# Altium schematic sheet 14 - mBUS-CAN.SchDoc
size B; CompanyName: Microchip Technology Inc.; Organization: Microchip Technology; Address1: 2355 West Chandler Blvd.; Address2: Chandler, AZ  85224; Address4: USA; DocumentNumber: 14; SheetNumber: 14; SheetTotal: 15; SheetTitle: mikroBUS CAN; Time: Time
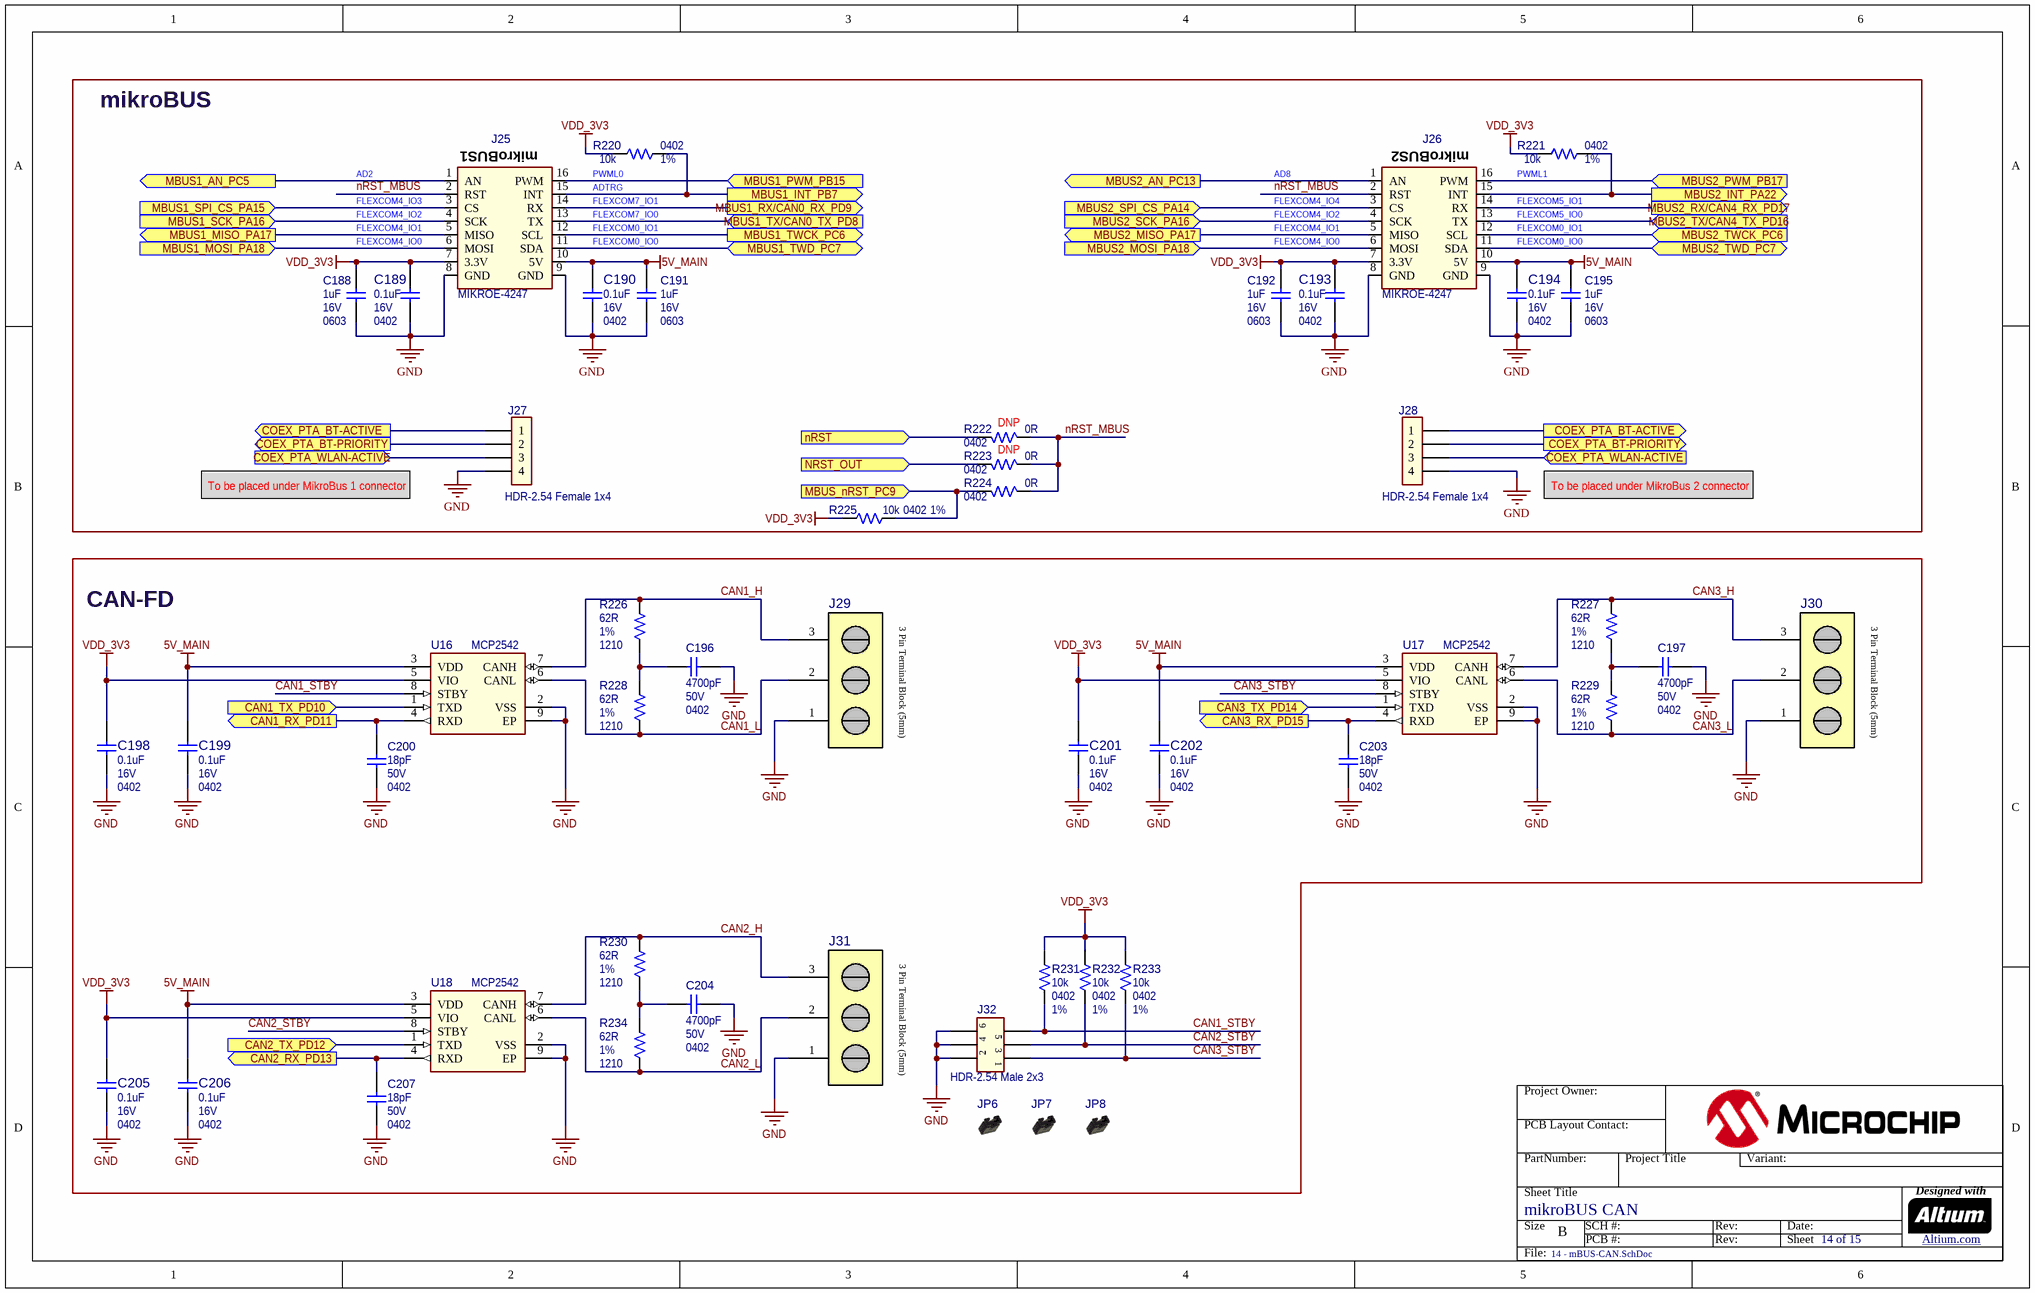
[diagram p0: 14 - mBUS-CAN.SchDoc]

## Parts
C188  value 1uF  Voltage: 16V  Package: 0603  [CAP_C_0603]  (hidden comment: Capacitor NP)
C189  value 0.1uF  Voltage: 16V  Package: 0402  [CAP_C_0402]  (hidden comment: Capacitor NP)
C190  value 0.1uF  Voltage: 16V  Package: 0402  [CAP_C_0402]  (hidden comment: Capacitor NP)
C191  value 1uF  Voltage: 16V  Package: 0603  [CAP_C_0603]  (hidden comment: Capacitor NP)
C192  value 1uF  Voltage: 16V  Package: 0603  [CAP_C_0603]  (hidden comment: Capacitor NP)
C193  value 0.1uF  Voltage: 16V  Package: 0402  [CAP_C_0402]  (hidden comment: Capacitor NP)
C194  value 0.1uF  Voltage: 16V  Package: 0402  [CAP_C_0402]  (hidden comment: Capacitor NP)
C195  value 1uF  Voltage: 16V  Package: 0603  [CAP_C_0603]  (hidden comment: Capacitor NP)
C196  value 4700pF  Voltage: 50V  Package: 0402  [CAP_C_0402]  (hidden comment: Capacitor NP)
C197  value 4700pF  Voltage: 50V  Package: 0402  [CAP_C_0402]  (hidden comment: Capacitor NP)
C198  value 0.1uF  Voltage: 16V  Package: 0402  [CAP_C_0402]  (hidden comment: Capacitor NP)
C199  value 0.1uF  Voltage: 16V  Package: 0402  [CAP_C_0402]  (hidden comment: Capacitor NP)
C200  value 18pF  Voltage: 50V  Package: 0402  [CAP_C_0402]  (hidden comment: Capacitor NP)
C201  value 0.1uF  Voltage: 16V  Package: 0402  [CAP_C_0402]  (hidden comment: Capacitor NP)
C202  value 0.1uF  Voltage: 16V  Package: 0402  [CAP_C_0402]  (hidden comment: Capacitor NP)
C203  value 18pF  Voltage: 50V  Package: 0402  [CAP_C_0402]  (hidden comment: Capacitor NP)
C204  value 4700pF  Voltage: 50V  Package: 0402  [CAP_C_0402]  (hidden comment: Capacitor NP)
C205  value 0.1uF  Voltage: 16V  Package: 0402  [CAP_C_0402]  (hidden comment: Capacitor NP)
C206  value 0.1uF  Voltage: 16V  Package: 0402  [CAP_C_0402]  (hidden comment: Capacitor NP)
C207  value 18pF  Voltage: 50V  Package: 0402  [CAP_C_0402]  (hidden comment: Capacitor NP)
J25  value MIKROE-4247  [SOCKET_mikroBUS_F_2.54_2x8_V_25.4x21_original]  (hidden comment: SOCKET mikroBUS HOST)
J26  value MIKROE-4247  [SOCKET_mikroBUS_F_2.54_2x8_V_25.4x21_original]  (hidden comment: SOCKET mikroBUS HOST)
J27  value HDR-2.54 Female 1x4  [HDR_F_2.54_1x4]  (hidden comment: Header 1x4)
J28  value HDR-2.54 Female 1x4  [HDR_F_2.54_1x4]  (hidden comment: Header 1x4)
J29  CON TERM BLK 1x3 TH Mount  [CON_TERMINAL_3.5_1x3_TH_RA_PHO_1985205]  (value not drawn)
J30  CON TERM BLK 1x3 TH Mount  [CON_TERMINAL_3.5_1x3_TH_RA_PHO_1985205]  (value not drawn)
J31  CON TERM BLK 1x3 TH Mount  [CON_TERMINAL_3.5_1x3_TH_RA_PHO_1985205]  (value not drawn)
J32  value HDR-2.54 Male 2x3  [HDR_M_2.54_2x3]  (hidden comment: Header 2x3)
JP6  Jumper Mechanical  [Jumper_Mechanical]  (value not drawn)  (mechanical)
JP7  Jumper Mechanical  [Jumper_Mechanical]  (value not drawn)  (mechanical)
JP8  Jumper Mechanical  [Jumper_Mechanical]  (value not drawn)  (mechanical)
R220  value 10k  Package: 0402  Tolerance: 1%  [RES_C_0402]  (hidden comment: Resistor)
R221  value 10k  Package: 0402  Tolerance: 1%  [RES_C_0402]  (hidden comment: Resistor)
R222  value 0R  Package: 0402  Populated: DNP  [RES_C_0402]  (hidden comment: Resistor)
R223  value 0R  Package: 0402  Populated: DNP  [RES_C_0402]  (hidden comment: Resistor)
R224  value 0R  Package: 0402  [RES_C_0402]  (hidden comment: Resistor)
R225  value 10k  Package: 0402  Tolerance: 1%  [RES_C_0402]  (hidden comment: Resistor)
R226  value 62R  Package: 1210  Tolerance: 1%  [RES_C_1210]  (hidden comment: Resistor)
R227  value 62R  Package: 1210  Tolerance: 1%  [RES_C_1210]  (hidden comment: Resistor)
R228  value 62R  Package: 1210  Tolerance: 1%  [RES_C_1210]  (hidden comment: Resistor)
R229  value 62R  Package: 1210  Tolerance: 1%  [RES_C_1210]  (hidden comment: Resistor)
R230  value 62R  Package: 1210  Tolerance: 1%  [RES_C_1210]  (hidden comment: Resistor)
R231  value 10k  Package: 0402  Tolerance: 1%  [RES_C_0402]  (hidden comment: Resistor)
R232  value 10k  Package: 0402  Tolerance: 1%  [RES_C_0402]  (hidden comment: Resistor)
R233  value 10k  Package: 0402  Tolerance: 1%  [RES_C_0402]  (hidden comment: Resistor)
R234  value 62R  Package: 1210  Tolerance: 1%  [RES_C_1210]  (hidden comment: Resistor)
U16  value MCP2542  [DFN-8_3x3_EP2.4X1.55]  (hidden comment: MCP2542 DFN-8)
U17  value MCP2542  [DFN-8_3x3_EP2.4X1.55]  (hidden comment: MCP2542 DFN-8)
U18  value MCP2542  [DFN-8_3x3_EP2.4X1.55]  (hidden comment: MCP2542 DFN-8)

## Blocks framed on the sheet
mikroBUS: C188-C195 J25-J28 R220-R225
CAN-FD: C196-C207 J29-J32 JP6-JP8 R226-R234 U16-U18

## Ports
CAN1_RX_PD11 (out), CAN1_TX_PD10 (in), CAN2_RX_PD13 (out), CAN2_TX_PD12 (in), CAN3_RX_PD15 (out), CAN3_TX_PD14 (in), COEX_PTA_BT-ACTIVE (out), COEX_PTA_BT-PRIORITY (out), COEX_PTA_WLAN-ACTIVE (in), MBUS1_AN_PC5 (out), MBUS1_INT_PB7 (out), MBUS1_MISO_PA17 (out), MBUS1_MOSI_PA18 (in), MBUS1_PWM_PB15 (in), MBUS1_RX/CAN0_RX_PD9 (out), MBUS1_SCK_PA16 (in), MBUS1_SPI_CS_PA15 (in), MBUS1_TWCK_PC6 (out), MBUS1_TWD_PC7 (bidir), MBUS1_TX/CAN0_TX_PD8 (in), MBUS2_AN_PC13 (out), MBUS2_INT_PA22 (out), MBUS2_MISO_PA17 (out), MBUS2_MOSI_PA18 (in), MBUS2_PWM_PB17 (in), MBUS2_RX/CAN4_RX_PD17 (out), MBUS2_SCK_PA16 (in), MBUS2_SPI_CS_PA14 (in), MBUS2_TWCK_PC6 (in), MBUS2_TWD_PC7 (bidir), MBUS2_TX/CAN4_TX_PD16 (in), MBUS_nRST_PC9 (in), nRST (in), NRST_OUT (in)

## Nets
5V_MAIN: C190.2 C191.2 C194.2 C195.2 C199.1 C202.1 C206.1 J25.10(5V) J26.10(5V) U16.3(VDD) U17.3(VDD) U18.3(VDD)
GND: C188.1 C189.1 C190.1 C191.1 C192.1 C193.1 C194.1 C195.1 C196.1 C197.1 C198.2 C199.2 C200.1 C201.2 C202.2 C203.1 C204.1 C205.2 C206.2 C207.1 J25.8(GND) J25.9(GND) J26.8(GND) J26.9(GND) J27.4 J28.4 J29.1 J30.1 J31.1 J32.2 J32.4 J32.6 U16.2(VSS) U16.9(EP) U17.2(VSS) U17.9(EP) U18.2(VSS) U18.9(EP)
VDD_3V3: C188.2 C189.2 C192.2 C193.2 C198.1 C201.1 C205.1 J25.7(3.3V) J26.7(3.3V) R220.2 R221.2 R225.2 R231.2 R232.2 R233.2 U16.5(VIO) U17.5(VIO) U18.5(VIO)
CAN1_H: J29.3 R226.2 U16.7(CANH)
CAN1_L: J29.2 R228.1 U16.6(CANL)
CAN1_RX_PD11: C200.2 U16.4(RXD) ; port CAN1_RX_PD11
CAN1_STBY: J32.5 R231.1 U16.8(STBY)
CAN1_TX_PD10: U16.1(TXD) ; port CAN1_TX_PD10
CAN2_H: J31.3 R230.2 U18.7(CANH)
CAN2_L: J31.2 R234.1 U18.6(CANL)
CAN2_RX_PD13: C207.2 U18.4(RXD) ; port CAN2_RX_PD13
CAN2_STBY: J32.3 R232.1 U18.8(STBY)
CAN2_TX_PD12: U18.1(TXD) ; port CAN2_TX_PD12
CAN3_H: J30.3 R227.2 U17.7(CANH)
CAN3_L: J30.2 R229.1 U17.6(CANL)
CAN3_RX_PD15: C203.2 U17.4(RXD) ; port CAN3_RX_PD15
CAN3_STBY: J32.1 R233.1 U17.8(STBY)
CAN3_TX_PD14: U17.1(TXD) ; port CAN3_TX_PD14
COEX_PTA_BT-ACTIVE: J27.1 J28.1 ; port COEX_PTA_BT-ACTIVE
COEX_PTA_BT-PRIORITY: J27.2 J28.2 ; port COEX_PTA_BT-PRIORITY
COEX_PTA_WLAN-ACTIVE: J27.3 J28.3 ; port COEX_PTA_WLAN-ACTIVE
MBUS1_AN_PC5: J25.1(AN) ; port MBUS1_AN_PC5
MBUS1_INT_PB7: J25.15(INT) R220.1 ; port MBUS1_INT_PB7
MBUS1_MISO_PA17: J25.5(MISO) ; port MBUS1_MISO_PA17
MBUS1_MOSI_PA18: J25.6(MOSI) ; port MBUS1_MOSI_PA18
MBUS1_PWM_PB15: J25.16(PWM) ; port MBUS1_PWM_PB15
MBUS1_RX/CAN0_RX_PD9: J25.14(RX) ; port MBUS1_RX/CAN0_RX_PD9
MBUS1_SCK_PA16: J25.4(SCK) ; port MBUS1_SCK_PA16
MBUS1_SPI_CS_PA15: J25.3(CS) ; port MBUS1_SPI_CS_PA15
MBUS1_TWCK_PC6: J25.12(SCL) ; port MBUS1_TWCK_PC6
MBUS1_TWD_PC7: J25.11(SDA) ; port MBUS1_TWD_PC7
MBUS1_TX/CAN0_TX_PD8: J25.13(TX) ; port MBUS1_TX/CAN0_TX_PD8
MBUS2_AN_PC13: J26.1(AN) ; port MBUS2_AN_PC13
MBUS2_INT_PA22: J26.15(INT) R221.1 ; port MBUS2_INT_PA22
MBUS2_MISO_PA17: J26.5(MISO) ; port MBUS2_MISO_PA17
MBUS2_MOSI_PA18: J26.6(MOSI) ; port MBUS2_MOSI_PA18
MBUS2_PWM_PB17: J26.16(PWM) ; port MBUS2_PWM_PB17
MBUS2_RX/CAN4_RX_PD17: J26.14(RX) ; port MBUS2_RX/CAN4_RX_PD17
MBUS2_SCK_PA16: J26.4(SCK) ; port MBUS2_SCK_PA16
MBUS2_SPI_CS_PA14: J26.3(CS) ; port MBUS2_SPI_CS_PA14
MBUS2_TWCK_PC6: J26.12(SCL) ; port MBUS2_TWCK_PC6
MBUS2_TWD_PC7: J26.11(SDA) ; port MBUS2_TWD_PC7
MBUS2_TX/CAN4_TX_PD16: J26.13(TX) ; port MBUS2_TX/CAN4_TX_PD16
MBUS_nRST_PC9: R224.1 R225.1 ; port MBUS_nRST_PC9
nRST: R222.1 ; port nRST
nRST_MBUS: J25.2(RST) J26.2(RST) R222.2 R223.2 R224.2
NRST_OUT: R223.1 ; port NRST_OUT
NetC196_2: C196.2 R226.1 R228.2
NetC197_2: C197.2 R227.1 R229.2
NetC204_2: C204.2 R230.1 R234.2

## Notes on the sheet
- (near J25) mikroBUS1
- (near J26) mikroBUS2
- AD2
- (near J25) FLEXCOM4_IO3
- FLEXCOM4_IO2
- FLEXCOM4_IO1
- FLEXCOM0_IO1
- FLEXCOM7_IO1
- FLEXCOM7_IO0
- (near R220) PWML0
- ADTRG
- AD8
- (near J26) FLEXCOM4_IO4
- (near R221) PWML1
- FLEXCOM5_IO1
- FLEXCOM5_IO0
- FLEXCOM4_IO0
- FLEXCOM0_IO0
- To be placed under MikroBus 1 connector
- To be placed under MikroBus 2 connector
- Project Owner:
- PCB Layout Contact:
- PartNumber:
- Project Title
- Variant:
- Sheet Title
- Size
- B
- SCH #:
- PCB #:
- Rev:
- Date:
- Sheet
- Designed with
- Altium.com <http://go.altium.com/MicrochipLandingPage_Evaluation.html>
- File:
- (in symbol CON2765) 3 Pin Terminal Block (5mm)

## Library data of the parts
C188 C191 C192 C195 = CAP0265: Manufacturer 1: AVX; Manufacturer Part Number 1: 0603YD105KAT2A; Description_: CAP CER 1uF 16V 10% X5R SMD 0603; Dev Tools Status: Production; Tolerance: 10%; Temperature Coefficient: X5R; Type: Ceramic; Populated: Yes; MCHP-ID: CAP0265; Revision: 4; Symbol: Capacitor NP; Status: MCL Design; ComponentLink1URL: https://chn-vm-apps.microchip.com/mchprepo/parts/Datasheets/smccp.pdf; ComponentLink1Description: SVN Datasheet; ComponentLink2URL: C:\ALTIUM_WORK\00001_MCHP-CDB\Datasheets\smccp.pdf; ComponentLink2Description: Local Datasheet; ComponentLink3URL: C:\ALTIUM_WORK\00001_MCHP-CDB\Library\LibraryRefs\Capacitor NP.SchLib; ComponentLink3Description: Open Symbol; ComponentLink4URL: C:\ALTIUM_WORK\00001_MCHP-CDB\Library\Footprints\CAP_C_0603.PcbLib; ComponentLink4Description: Open Footprint; ComponentLink5Description: Open Footprint 2; ComponentLink6Description: Open Footprint 3; ComponentLink7Description: Open Footprint 4; Operating Temperature: -55C to +85C; Category: Capacitor; Manufacturer 2: KEMET; Manufacturer Part Number 2: C0603C105K4PACTU; Manufacturer 3: TDK; Manufacturer Part Number 3: C1608X5R1C105K080AA; Manufacturer 4: Vishay Vitramon; Manufacturer Part Number 4: VJ0603G105KXJCW1BC; Manufacturer 5: Yageo; Manufacturer Part Number 5: CC0603KRX5R7BB105; Supplier 1: Digi-Key; Supplier Part Number 1: 478-1249-1-ND; Supplier 2: Digi-Key; Supplier Part Number 2: 399-5090-1-ND; Supplier 3: Digi-Key; Supplier Part Number 3: 445-1416-1-ND; Supplier 4: Digi-Key; Supplier Part Number 4: 720-1851-1-ND; Supplier 5: Digi-Key; Supplier Part Number 5: 311-1444-1-ND; Quantity Override: 1
C189 C190 C193 C194 C198 C199 C201 C202 C205 C206 = CAP1033: Manufacturer 1: Hottech; Manufacturer Part Number 1: C1005B104K160NT; Description_: CAP CER 0.1uF 16V 10% X7R SMD 0402; Dev Tools Status: Production; Tolerance: 10%; Type: Ceramic; Owner: Sompoch Loboonlert; Populated: Yes; Temperature Coefficient: X7R; Restricted Sourcing: No; MCHP-ID: CAP1033; Revision: 10; Symbol: Capacitor NP; Status: MCL Design; ComponentLink1URL: https://chn-vm-apps.microchip.com/mchprepo/parts/Datasheets/L0005E.pdf; ComponentLink1Description: SVN Datasheet; ComponentLink2URL: C:\ALTIUM_WORK\00001_MCHP-CDB\Datasheets\L0005E.pdf; ComponentLink2Description: Local Datasheet; ComponentLink3URL: C:\ALTIUM_WORK\00001_MCHP-CDB\Library\LibraryRefs\Capacitor NP.SchLib; ComponentLink3Description: Open Symbol; ComponentLink4URL: C:\ALTIUM_WORK\00001_MCHP-CDB\Library\Footprints\CAP_C_0402.PcbLib; ComponentLink4Description: Open Footprint; ComponentLink5Description: Open Footprint 2; ComponentLink6Description: Open Footprint 3; ComponentLink7Description: Open Footprint 4; Operating Temperature: -55C to +125C; Category: Capacitor; Supplier 1: Hottech; Supplier Part Number 1: C1005B104K160NT; Quantity Override: 1; Manufacturer 2: KEMET; Manufacturer Part Number 2: C0402C104K4RAC7867; Manufacturer 3: Samsung Electro-Mechanics; Manufacturer Part Number 3: CL05B104KO5NNNC; Supplier 2: Digi-Key; Supplier Part Number 2: 399-C0402C104K4RAC7867TR-ND; Supplier 3: Digi-Key; Supplier Part Number 3: 1276-1001-1-ND; Manufacturer 4: Würth Elektronik; Manufacturer Part Number 4: 885012205037; Manufacturer 5: Samsung Electro-Mechanics; Manufacturer Part Number 5: CL05B104KO5NNND; Manufacturer 6: Samsung Electro-Mechanics; Manufacturer Part Number 6: CL05B104KO5NNNO; Manufacturer 7: Yageo; Manufacturer Part Number 7: CC0402KRX7R7BB104; Supplier 4: Digi-Key; Supplier Part Number 4: 732-7532-1-ND; Supplier 5: Mouser; Supplier Part Number 5: 187-CL05B104KO5NNND; Supplier 6: Samsung Electro-Mechanics; Supplier Part Number 6: CL05B104KO5NNNO; Supplier 7: Yageo; Supplier Part Number 7: CC0402KRX7R7BB104
C196 C197 C204 = CAP2376: Manufacturer 1: KEMET; Manufacturer Part Number 1: C0402C472K5RACTU; Description_: Ceramic capacitor, SMD 0402, X7R, 50V, +/-10%; Dev Tools Status: Design; Tolerance: 10%; Temperature Coeffcient: X7R; Type: Ceramic; Owner: Dragos Danaila; Populated: YES; MCHP-ID: CAP2376; Revision: 1; Symbol: Capacitor NP; Status: MCL Design; ComponentLink1URL: https://chn-vm-apps.microchip.com/mchprepo/parts/Datasheets/KEM_C1002_X7R_SMD-1102033.pdf; ComponentLink1Description: SVN Datasheet; ComponentLink2URL: C:\ALTIUM_WORK\00001_MCHP-CDB\Datasheets\KEM_C1002_X7R_SMD-1102033.pdf; ComponentLink2Description: Local Datasheet; ComponentLink3URL: C:\ALTIUM_WORK\00001_MCHP-CDB\Library\LibraryRefs\Capacitor NP.SchLib; ComponentLink3Description: Open Symbol; ComponentLink4URL: C:\ALTIUM_WORK\00001_MCHP-CDB\Library\Footprints\CAP_C_0402.PcbLib; ComponentLink4Description: Open Footprint; ComponentLink5Description: Open Footprint 2; ComponentLink6Description: Open Footprint 3; ComponentLink7Description: Open Footprint 4; Operating Temperature: -55C to +125C; Category: Capacitor; Supplier 1: Mouser; Supplier Part Number 1: 80-C0402C472K5R; Quantity Override: 1
C200 C203 C207 = CAP1091: Manufacturer 1: Murata; Manufacturer Part Number 1: GCM1555C1H180JA16D; Description_: CAP CER 18pF 50V 5% C0G SMD 0402; Dev Tools Status: Production; Tolerance: 5%; Type: Ceramic; Populated: YES; Owner: Tad Ahlvers; Temperature Coefficient: C0G; Restricted Sourcing: No; MCHP-ID: CAP1091; Revision: 5; Symbol: Capacitor NP; Status: MCL Design; ComponentLink1URL: https://chn-vm-apps.microchip.com/mchprepo/parts/Datasheets/c02e.pdf; ComponentLink1Description: SVN Datasheet; ComponentLink2URL: C:\ALTIUM_WORK\00001_MCHP-CDB\Datasheets\c02e.pdf; ComponentLink2Description: Local Datasheet; ComponentLink3URL: C:\ALTIUM_WORK\00001_MCHP-CDB\Library\LibraryRefs\Capacitor NP.SchLib; ComponentLink3Description: Open Symbol; ComponentLink4URL: C:\ALTIUM_WORK\00001_MCHP-CDB\Library\Footprints\CAP_C_0402.PcbLib; ComponentLink4Description: Open Footprint; ComponentLink5Description: Open Footprint 2; ComponentLink6Description: Open Footprint 3; ComponentLink7Description: Open Footprint 4; Operating Temperature: -55C to +125C; Category: Capacitor; Supplier 1: Digi-Key; Supplier Part Number 1: 490-12650-2-ND; Quantity Override: 1; Manufacturer 2: Murata; Manufacturer Part Number 2: GRM1555C1H180JA01D; Manufacturer 3: Samsung Electro-Mechanics; Manufacturer Part Number 3: CL05C180JB5NNNC; Manufacturer 4: Yageo; Manufacturer Part Number 4: CC0402JRNPO9BN180; Manufacturer 5: Murata; Manufacturer Part Number 5: GRM1555C1H180JZ01; Supplier 2: Digi-Key; Supplier Part Number 2: 490-5858-1-ND; Supplier 3: Samsung Electro-Mechanics; Supplier Part Number 3: CL05C180JB5NNNC; Supplier 4: Yageo; Supplier Part Number 4: CC0402JRNPO9BN180; Supplier 5: Murata; Supplier Part Number 5: GRM1555C1H180JZ01
J25 J26 = SKT1157: Manufacturer 1: MikroElektronika; Description_: SOCKET mikroBUS HOST DIP 16 TH; Dev Tools Status: Design; Owner: Dragos Danaila; Populated: YES; MCHP-ID: SKT1157; Revision: 2; Symbol: SOCKET mikroBUS HOST; Status: MCL Design; ComponentLink1URL: https://chn-vm-apps.microchip.com/mchprepo/parts/Datasheets/MIKROE-4247.pdf; ComponentLink1Description: SVN Datasheet; ComponentLink2URL: C:\ALTIUM_WORK\00001_MCHP-CDB\Datasheets\MIKROE-4247.pdf; ComponentLink2Description: Local Datasheet; ComponentLink3URL: C:\ALTIUM_WORK\00001_MCHP-CDB\Library\LibraryRefs\SOCKET mikroBUS HOST.SchLib; ComponentLink3Description: Open Symbol; ComponentLink4URL: C:\ALTIUM_WORK\00001_MCHP-CDB\Library\Footprints\SOCKET_mikroBUS_F_2.54_2x8_V_25.4x21_original.PcbLib; ComponentLink4Description: Open Footprint; ComponentLink5Description: Open Footprint 2; ComponentLink6Description: Open Footprint 3; ComponentLink7Description: Open Footprint 4; Type: MikroBUS; Category: Socket; Manufacturer Part Number 1: MIKROE-4247; Manufacturer 2: MikroElektronika; Manufacturer Part Number 2: MIKROE-4247; Supplier 1: TME; Supplier Part Number 1: MIKROE-4247; Supplier 2: TME; Supplier Part Number 2: MIKROE-4247; Quantity Override: 1
J27 J28 = CON2750: Manufacturer 1: Sullins Connector Solutions; Manufacturer Part Number 1: PPTC041LFBN-RC; Description_: CON HDR-2.54 Female 1x4 Tin TH VERT; Dev Tools Status: Design; Populated: YES; Owner: Ciprian Abramov; Voltage: 250V; Current: 3A; Restricted Sourcing: No; MCHP-ID: CON2750; Revision: 1; Symbol: Header 1x4; Status: MCL Design; ComponentLink1URL: https://chn-vm-apps.microchip.com/mchprepo/parts/Datasheets/Female_Headers.100_DS.pdf; ComponentLink1Description: SVN Datasheet; ComponentLink2URL: C:\ALTIUM_WORK\00001_MCHP-CDB\Datasheets\Female_Headers.100_DS.pdf; ComponentLink2Description: Local Datasheet; ComponentLink3URL: C:\ALTIUM_WORK\00001_MCHP-CDB\Library\LibraryRefs\Header 1x4.SchLib; ComponentLink3Description: Open Symbol; ComponentLink4URL: C:\ALTIUM_WORK\00001_MCHP-CDB\Library\Footprints\HDR_F_2.54_1x4.PcbLib; ComponentLink4Description: Open Footprint; ComponentLink5Description: Open Footprint 2; ComponentLink6Description: Open Footprint 3; ComponentLink7Description: Open Footprint 4; Type: Header 2.54mm; Category: Connector; Supplier 1: Digi-Key; Supplier Part Number 1: S7002-ND; Quantity Override: 1; Operating Temperature: -40C to 105C; Assembly Type: TH
J29-J31 = CON2765: Manufacturer 1: Phoenix Contact; Manufacturer Part Number 1: 1985205; Value: Terminal Block 1x3; Description_: CON TERMINAL 3.5mm 1x3 Female 16-24AWG 8A TH 45deg; Dev Tools Status: Design; Owner: Ciprian Abramov; Voltage: 400V; Populated: YES; Restricted Sourcing: No; Current: 8A; MCHP-ID: CON2765; Revision: 1; Symbol: CON TERM BLK 1x3 TH Mount; Status: MCL Design; ComponentLink1URL: https://chn-vm-apps.microchip.com/mchprepo/parts/Datasheets/COMBICON%20Spring-Cage%20PCB%20Term.%20Blocks.pdf; ComponentLink1Description: SVN Datasheet; ComponentLink2URL: C:\ALTIUM_WORK\00001_MCHP-CDB\Datasheets\COMBICON%20Spring-Cage%20PCB%20Term.%20Blocks.pdf; ComponentLink2Description: Local Datasheet; ComponentLink3URL: C:\ALTIUM_WORK\00001_MCHP-CDB\Library\LibraryRefs\CON TERM BLK 1x3 TH Mount.SchLib; ComponentLink3Description: Open Symbol; ComponentLink4URL: C:\ALTIUM_WORK\00001_MCHP-CDB\Library\Footprints\CON_TERMINAL_3.5_1x3_TH_RA_PHO_1985205.PcbLib; ComponentLink4Description: Open Footprint; ComponentLink5Description: Open Footprint 2; ComponentLink6Description: Open Footprint 3; ComponentLink7Description: Open Footprint 4; Type: Terminal Block; Category: Connector; Supplier 1: Digi-Key; Supplier Part Number 1: 277-1623-ND; Quantity Override: 1; Assembly Type: TH; Operating Temperature: -40C to 100C
J32 = CON0322: Manufacturer 1: Sullins Connector Solutions; Manufacturer Part Number 1: PBC03DAAN; Description_: CON HDR-2.54 Male 2x3 Gold 5.84MH TH VERT; Dev Tools Status: Production; Populated: Yes; Restricted Sourcing: No; MCHP-ID: CON0322; Revision: 3; Symbol: Header 2x3; Status: MCL Design; ComponentLink1URL: https://chn-vm-apps.microchip.com/mchprepo/parts/Datasheets/HTSW-XXX-XX-XXX-X-XX-XX-XX-MKT.pdf; ComponentLink1Description: SVN Datasheet; ComponentLink2URL: C:\ALTIUM_WORK\00001_MCHP-CDB\Datasheets\HTSW-XXX-XX-XXX-X-XX-XX-XX-MKT.pdf; ComponentLink2Description: Local Datasheet; ComponentLink3URL: C:\ALTIUM_WORK\00001_MCHP-CDB\Library\LibraryRefs\Header 2x3.SchLib; ComponentLink3Description: Open Symbol; ComponentLink4URL: C:\ALTIUM_WORK\00001_MCHP-CDB\Library\Footprints\HDR_M_2.54_2x3.PcbLib; ComponentLink4Description: Open Footprint; ComponentLink5Description: Open Footprint 2; ComponentLink6Description: Open Footprint 3; ComponentLink7Description: Open Footprint 4; Type: Header 2.54mm; Category: Connector; Supplier 1: Digi-Key; Supplier Part Number 1: S2011E-03-ND; Quantity Override: 1; Manufacturer 2: SHENZHEN JUNHAO ENGINEERING; Manufacturer Part Number 2: 213-0617-0021-401; Manufacturer 3: Samtec; Manufacturer Part Number 3: HTSW-103-07-G-D; Supplier 2: SHENZHEN JUNHAO ENGINEERING; Supplier Part Number 2: 213-0617-0021-401; Supplier 3: Samtec; Supplier Part Number 3: HTSW-103-07-G-D
JP6-JP8 = MECH0174: Manufacturer 1: Wurth Electronics Inc.; Manufacturer Part Number 1: 60900213421; Value: Shunt 2.54mm 1x2; Description_: MECH HW JUMPER 2.54mm 1x2 GOLD; Dev Tools Status: Production; Owner: Narasimha Murthy; Populated: MECH; MCHP-ID: MECH0174; Revision: 1; Symbol: Jumper Mechanical; Status: MCL Design; ComponentLink1URL: https://chn-vm-apps.microchip.com/mchprepo/parts/Datasheets/60900213421.pdf; ComponentLink1Description: SVN Datasheet; ComponentLink2URL: C:\ALTIUM_WORK\00001_MCHP-CDB\Datasheets\60900213421.pdf; ComponentLink2Description: Local Datasheet; ComponentLink3URL: C:\ALTIUM_WORK\00001_MCHP-CDB\Library\LibraryRefs\Jumper Mechanical.SchLib; ComponentLink3Description: Open Symbol; ComponentLink4URL: C:\ALTIUM_WORK\00001_MCHP-CDB\Library\Footprints\Jumper_Mechanical.PcbLib; ComponentLink4Description: Open Footprint; ComponentLink5Description: Open Footprint 2; ComponentLink6Description: Open Footprint 3; ComponentLink7Description: Open Footprint 4; Type: Jumper; Category: Hardware; Supplier 1: Digi-Key; Supplier Part Number 1: 732-2678-ND; Quantity Override: 1
R220 R221 R225 R231-R233 = RSMT1019: Manufacturer 1: Panasonic; Manufacturer Part Number 1: ERJ-2RKF1002X; Description_: RES TKF 10k 1% 1/10W SMD 0402; Dev Tools Status: Production; Voltage: 50V; Temperature Coeffcient: 100ppm/C; Power: 1/10W; Owner: Brent Lanphear; Populated: YES; MCHP-ID: RSMT1019; Revision: 2; Symbol: Resistor; Status: MCL Design; ComponentLink1URL: https://chn-vm-apps.microchip.com/mchprepo/parts/Datasheets/AOA0000CE2.pdf; ComponentLink1Description: SVN Datasheet; ComponentLink2URL: C:\ALTIUM_WORK\00001_MCHP-CDB\Datasheets\AOA0000CE2.pdf; ComponentLink2Description: Local Datasheet; ComponentLink3URL: C:\ALTIUM_WORK\00001_MCHP-CDB\Library\LibraryRefs\Resistor.SchLib; ComponentLink3Description: Open Symbol; ComponentLink4URL: C:\ALTIUM_WORK\00001_MCHP-CDB\Library\Footprints\RES_C_0402.PcbLib; ComponentLink4Description: Open Footprint; ComponentLink5Description: Open Footprint 2; ComponentLink6Description: Open Footprint 3; ComponentLink7Description: Open Footprint 4; Operating Temperature: -55C to +155C; Category: Resistor; Type: RES SMD; Composition: TKF; Supplier 1: Digi-Key; Supplier Part Number 1: P10.0KLCT-ND; Quantity Override: 1
R222 R223 = RSMT1040: Manufacturer 1: Yageo; Manufacturer Part Number 1: RC0402JR-070RL; Description_: RES TKF 0R 1/16W SMD 0402; Dev Tools Status: Production; Power: 1/16W; Owner: Sompoch Loboonlert; MCHP-ID: RSMT1040; Revision: 3; Symbol: Resistor; Status: MCL Design; ComponentLink1URL: https://chn-vm-apps.microchip.com/mchprepo/parts/Datasheets/PYu-RC0402_51_RoHS_L_6.pdf; ComponentLink1Description: SVN Datasheet; ComponentLink2URL: C:\ALTIUM_WORK\00001_MCHP-CDB\Datasheets\PYu-RC0402_51_RoHS_L_6.pdf; ComponentLink2Description: Local Datasheet; ComponentLink3URL: C:\ALTIUM_WORK\00001_MCHP-CDB\Library\LibraryRefs\Resistor.SchLib; ComponentLink3Description: Open Symbol; ComponentLink4URL: C:\ALTIUM_WORK\00001_MCHP-CDB\Library\Footprints\RES_C_0402.PcbLib; ComponentLink4Description: Open Footprint; ComponentLink5Description: Open Footprint 2; ComponentLink6Description: Open Footprint 3; ComponentLink7Description: Open Footprint 4; Operating Temperature: -55C to +155C; Category: Resistor; Type: RES SMD; Composition: TKF; Manufacturer 2: Stackpole Electronics Inc; Manufacturer Part Number 2: RMCF0402ZT0R00; Supplier 1: Digi-Key; Supplier Part Number 1: 311-0.0JRCT-ND; Supplier 2: Digi-Key; Supplier Part Number 2: RMCF0402ZT0R00TR-ND; Quantity Override: 1
R224 = RSMT1040: Manufacturer 1: Yageo; Manufacturer Part Number 1: RC0402JR-070RL; Description_: RES TKF 0R 1/16W SMD 0402; Dev Tools Status: Production; Power: 1/16W; Populated: Yes; Owner: Sompoch Loboonlert; MCHP-ID: RSMT1040; Revision: 3; Symbol: Resistor; Status: MCL Design; ComponentLink1URL: https://chn-vm-apps.microchip.com/mchprepo/parts/Datasheets/PYu-RC0402_51_RoHS_L_6.pdf; ComponentLink1Description: SVN Datasheet; ComponentLink2URL: C:\ALTIUM_WORK\00001_MCHP-CDB\Datasheets\PYu-RC0402_51_RoHS_L_6.pdf; ComponentLink2Description: Local Datasheet; ComponentLink3URL: C:\ALTIUM_WORK\00001_MCHP-CDB\Library\LibraryRefs\Resistor.SchLib; ComponentLink3Description: Open Symbol; ComponentLink4URL: C:\ALTIUM_WORK\00001_MCHP-CDB\Library\Footprints\RES_C_0402.PcbLib; ComponentLink4Description: Open Footprint; ComponentLink5Description: Open Footprint 2; ComponentLink6Description: Open Footprint 3; ComponentLink7Description: Open Footprint 4; Operating Temperature: -55C to +155C; Category: Resistor; Type: RES SMD; Composition: TKF; Manufacturer 2: Stackpole Electronics Inc; Manufacturer Part Number 2: RMCF0402ZT0R00; Supplier 1: Digi-Key; Supplier Part Number 1: 311-0.0JRCT-ND; Supplier 2: Digi-Key; Supplier Part Number 2: RMCF0402ZT0R00TR-ND; Quantity Override: 1
R226-R230 R234 = RSMT1222: Manufacturer 1: Yageo; Manufacturer Part Number 1: RC1210FR-0762RL; Description_: RES TKF 62R 1% 1/2W SMD 1210; Dev Tools Status: Production; Voltage: 200V; Temperature Coeffcient: 100PPM/C; Current: 5.56A; Power: 1/2W; Owner: Dragos Danaila; Populated: YES; MCHP-ID: RSMT1222; Revision: 1; Symbol: Resistor; Status: MCL Design; ComponentLink1URL: https://chn-vm-apps.microchip.com/mchprepo/parts/Datasheets/PYu-RC1210_51_RoHS_L_(4)-2050.pdf; ComponentLink1Description: SVN Datasheet; ComponentLink2URL: C:\ALTIUM_WORK\00001_MCHP-CDB\Datasheets\PYu-RC1210_51_RoHS_L_(4)-2050.pdf; ComponentLink2Description: Local Datasheet; ComponentLink3URL: C:\ALTIUM_WORK\00001_MCHP-CDB\Library\LibraryRefs\Resistor.SchLib; ComponentLink3Description: Open Symbol; ComponentLink4URL: C:\ALTIUM_WORK\00001_MCHP-CDB\Library\Footprints\RES_C_1210.PcbLib; ComponentLink4Description: Open Footprint; ComponentLink5Description: Open Footprint 2; ComponentLink6Description: Open Footprint 3; ComponentLink7Description: Open Footprint 4; Operating Temperature: -55C to +155C; Category: Resistor; Type: RES SMD; Composition: TKF; Supplier 1: Mouser; Supplier Part Number 1: 603-RC1210FR-0762RL; Quantity Override: 1
U16-U18 = MIC7856: Manufacturer 1: Microchip Technology; Manufacturer Part Number 1: MCP2542FDT-E/MF; Description_: MCHP INTERFACE CAN MCP2542FDT-E/MF DFN-8; MAPS Description: CAN Transceiver; Dev Tools Status: Production; Owner: Ilie Galan; MPC: V7BC6YA7XA00; LeadContent: Pb-FREE; PackingMedia: T/R; Stage: REL; LeadCount: 8; PackageWidth: 3x3x0.9mm; ForceMinOrderQtyMult: True; MinOrderQty: 1; TempRange: -40C to +125C; tblDeviceFamilyID: 5993; DeviceType: Transceiver; OperatingVoltageMin: 4.5; OperatingVoltageMax: 5.5; StandbyCurrentMax: 15; OperatingCurrentMax: 10; PropDelayMax: 120; ShortCircuit: -58 to +58; TransientVoltage: -150 to +100; ESD: 13; ThermalShutdown: Yes; CMR: +/-12; Masks: 0; Comments: Flexible Data Rate Capable; MCHP-ID: MIC7856; Symbol: MCP2542 DFN-8; Type: CAN; Status: MCL Design; Revision: 1; Category: MCHP-Interface; ComponentLink1URL: http://www.microchip.com/wwwproducts/MCP2542FD; ComponentLink1Description: SVN Datasheet; ComponentLink2URL: C:\ALTIUM_WORK\00001_MCHP-CDB\Datasheets\MCP2542.pdf; ComponentLink2Description: Local Datasheet; ComponentLink3URL: C:\ALTIUM_WORK\00001_MCHP-CDB\Library\LibraryRefs\MCP2542 DFN-8.SchLib; ComponentLink3Description: Open Symbol; ComponentLink4URL: C:\ALTIUM_WORK\00001_MCHP-CDB\Library\Footprints\DFN-8_3x3_EP2.4X1.55.PcbLib; ComponentLink4Description: Open Footprint; ComponentLink5Description: Open Footprint 2; ComponentLink6Description: Open Footprint 3; ComponentLink7Description: Open Footprint 4; Supplier 1: Digi-Key; Supplier Part Number 1: MCP2542FDT-E/MFCT-ND; IntroductionDate: 2016-03-07; PackageType: DFN; BitrateMax: 8; TxDDominantDetector: Yes; Filters: 0; Populated: YES; Quantity Override: 1